# Altium schematic sheet EgSA-Cube3.SchDoc (part 3 of 3)
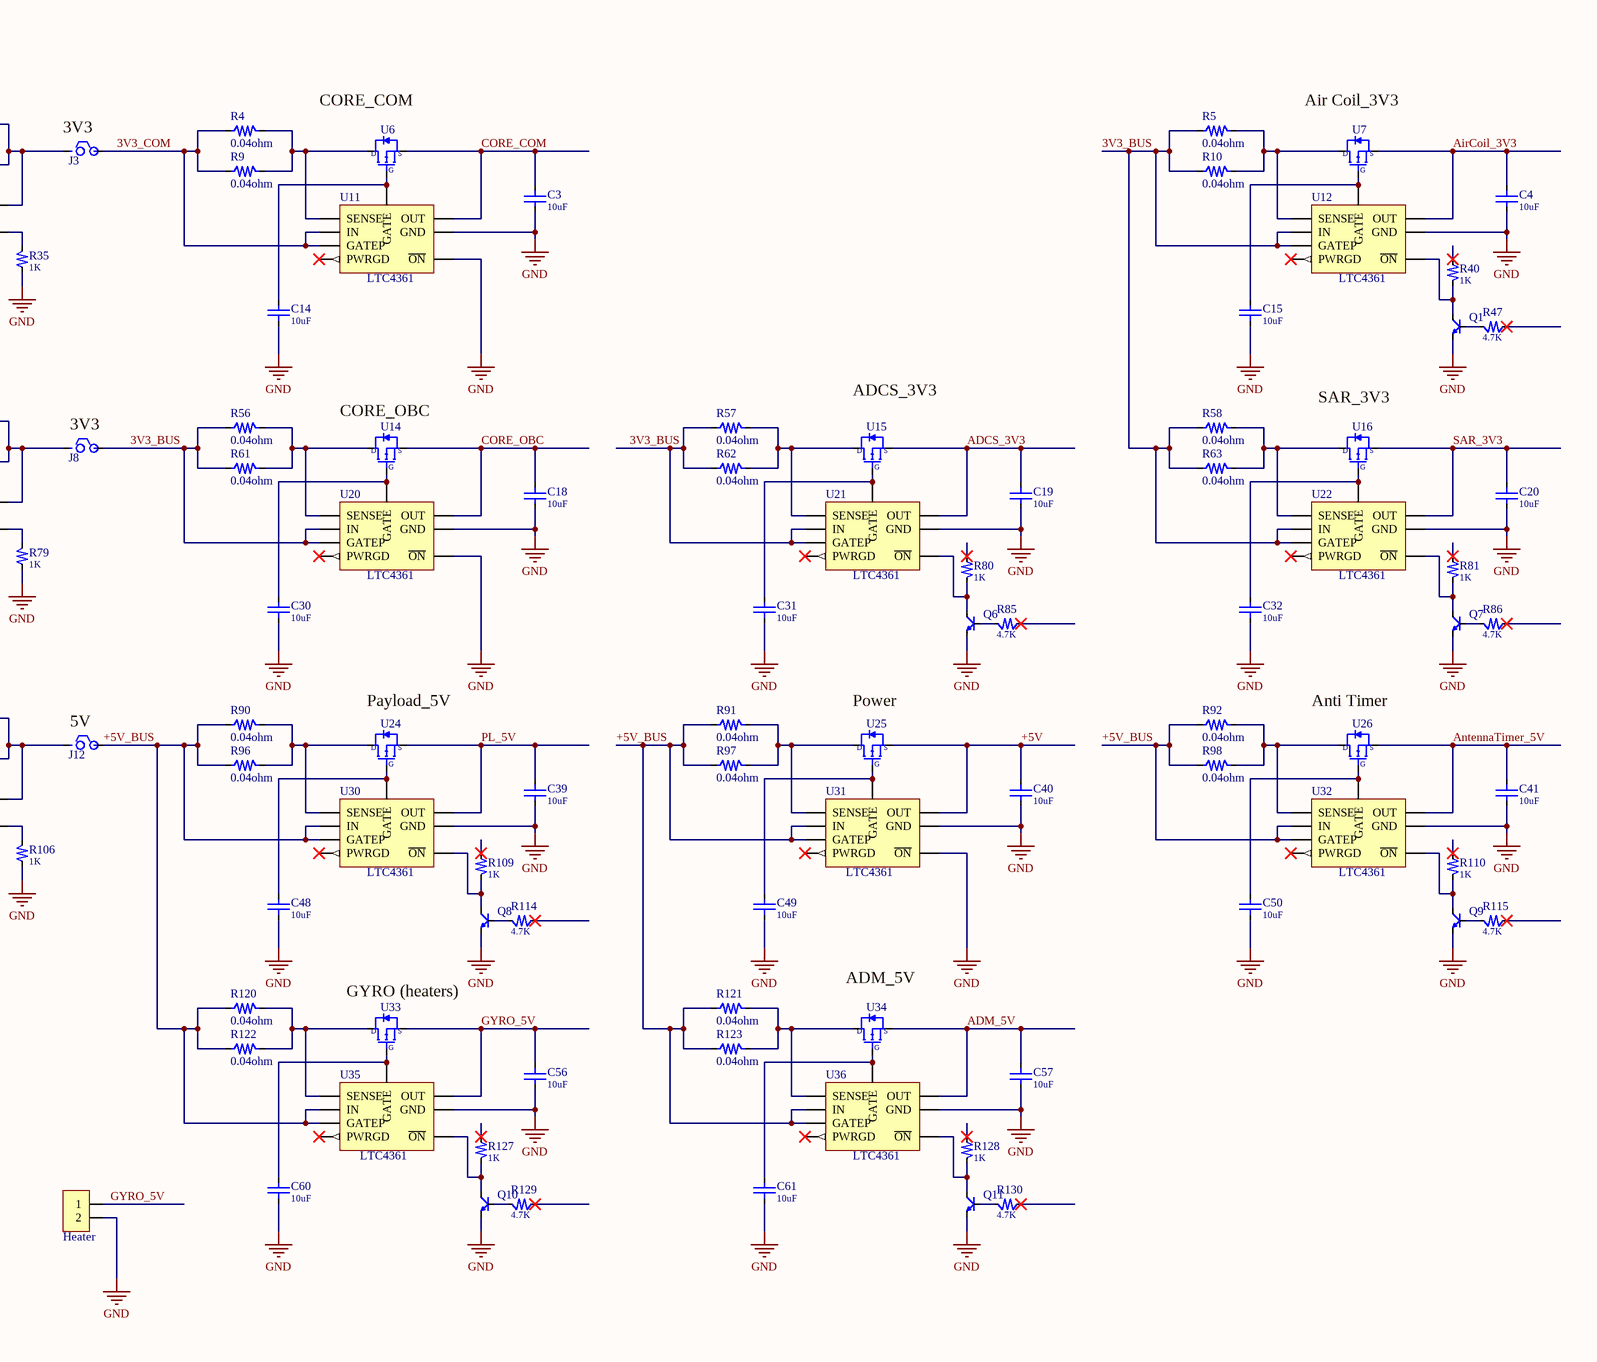
[diagram p5: EgSA-Cube3.SchDoc, bottom right]

## Library data of the parts (continued)
R51 R52 = ERJ-P6WF2702V: RES 27K OHM 1% 1/2W 0805; Manufacturer: Panasonic Electronic Components; Power (Watts): 0.5W, 1/2W; Temperature Coefficient: ±200ppm/°C; Supplier 1: Digi-Key; Manufacturer Part Number: ERJ-P6WF2702V; RoHS: RoHS Compliant; Category: Resistors; Stock 1: 2607; Pricing 1: 1=0.61, 10=0.465, 100=0.1956, 1000=0.10794, 2500=0.10119 (USD); Packaging: Cut Tape (CT); Part Status: Active; Tolerance: ±1%; Composition: Thick Film; Features: Automotive AEC-Q200, Pulse Withstanding; Operating Temperature: -55°C ~ 155°C; Package / Case: 0805 (2012 Metric); Supplier Device Package: 0805; Size / Dimension: 0.079" L x 0.049" W (2.00mm x 1.25mm); Height - Seated (Max): 0.030" (0.75mm); Failure Rate: -; ComponentLink1URL: https://industrial.panasonic.com/cdbs/www-data/pdf/RDO0000/RDO0000C337.pdf; ComponentLink1Description: https://industrial.panasonic.com/cdbs/www-data/pdf/RDO0000/RDO0000C337.pdf; Supplier Part Number 1: P16902CT-ND
R64 R72 = CRCW080520K0FKEAHP: RES 20K OHM 1% 1/2W 0805; Manufacturer: Vishay Dale; Resistance: 20kR; Temperature Coefficient: 100ppm/°C; Power Rating: 500mW; Voltage Rating: 150V; Max Power Dissipation: 333mW; Supplier 1: Digi-Key; Supplier Part Number 1: 541-20.0KTCT-ND; Manufacturer Part Number: CRCW080520K0FKEAHP; Stock 1: 10149; Pricing 1: 1=0.24, 10=0.204, 100=0.0798, 1000=0.0334, 2500=0.0306 (USD); Mount: Surface Mount; Case/Package: 0805; Weight: 0.000194oz; Contact Plating: Tin; Case Code (Imperial): 0805; Case Code (Metric): 2012; Min Operating Temperature: -55°C; Max Operating Temperature: 155°C; Tolerance: 1%; Composition: Thick Film; Packaging: Tape and Reel; Package Quantity: 10; Termination: SMD/SMT; Number of Terminations: 2; Features: Automotive AEC-Q200; Length: 2mm; Height: 0.024inch; Width: 1.2mm; Depth: 1.25mm; Radiation Hardening: No; Lead Free: Lead Free; ComponentLink1URL: http://www.vishay.com/docs/20043/crcwhpe3.pdf?src-supplier=Digi-Key; ComponentLink1Description: http://www.vishay.com/docs/20043/crcwhpe3.pdf?src-supplier=Digi-Key; ComponentLink2URL: http://www.vishay.com/docs/20043/crcwhpe3.pdf?src-supplier=Avnet; ComponentLink2Description: http://www.vishay.com/docs/20043/crcwhpe3.pdf?src-supplier=Avnet
R67 = ERJ-P06F1913V: RES 191K OHM 1% 1/2W 0805; Manufacturer: Panasonic; Manufacturer Part Number: ERJP06F1913V; Resistance: 191kR; Power Rating: 500mW; Voltage Rating: 150V; Temperature Coefficient: 100ppm/°C; Voltage Rating (DC): 400V; Supplier 1: Mouser; Supplier Part Number 1: 667-ERJ-P06F1913V; Stock 1: 9958; Pricing 1: 1=0.15, 10=0.086, 50=0.071, 100=0.048, 1000=0.022, 10000=0.016 (USD); Mount: Surface Mount; Case/Package: 0805; Case Code (Imperial): 0805; Case Code (Metric): 2012; Min Operating Temperature: -55°C; Max Operating Temperature: 155°C; Packaging: Tape and Reel; Tolerance: 1%; Package Quantity: 5000; Resistor Type: Thick Film; Length: 2mm; Width: 1.2mm; Height: 0.6mm; REACH SVHC: No SVHC; RoHS Compliant: Yes; ComponentLink1URL: http://www.farnell.com/datasheets/1801181.pdf?src-supplier=Element14; ComponentLink1Description: http://www.farnell.com/datasheets/1801181.pdf?src-supplier=Element14; ComponentLink2URL: http://www.farnell.com/datasheets/2059624.pdf?src-supplier=Farnell; ComponentLink2Description: http://www.farnell.com/datasheets/2059624.pdf?src-supplier=Farnell; ComponentLink3URL: http://www.mouser.com/ds/2/315/AOA0000C291-1101061.pdf?src-supplier=Mouser; ComponentLink3Description: http://www.mouser.com/ds/2/315/AOA0000C291-1101061.pdf?src-supplier=Mouser
R95 = CRCW08055K62FKEAHP: RES 5.62K OHM 1% 1/2W 0805; Manufacturer: Vishay Dale; Resistance: 5.62kR; Max Power Dissipation: 500mW; Temperature Coefficient: 100ppm/°C; Supplier 1: Mouser; Supplier Part Number 1: 71-CRCW08055K62FKEAH; Manufacturer Part Number: CRCW08055K62FKEAHP; Stock 1: 641; Pricing 1: 1=0.26, 10=0.222, 50=0.222, 100=0.086, 1000=0.033, 10000=0.025 (USD); Case/Package: 0805; Case Code (Metric): 2012; Case Code (Imperial): 0805; Min Operating Temperature: -55°C; Max Operating Temperature: 155°C; Package Quantity: 5000; Tolerance: 1%; Packaging: Cut Tape; Resistor Type: Thick Film; Number of Terminations: 2; Features: Automotive AEC-Q200; Series: CRCW-HP; Length: 0.079inch; Width: 0.049inch; Height: 0.024inch; Lead Free: Lead Free; RoHS Compliant: Yes; ComponentLink1URL: http://www.vishay.com/docs/20043/crcwhpe3.pdf?src-supplier=Digi-Key; ComponentLink1Description: http://www.vishay.com/docs/20043/crcwhpe3.pdf?src-supplier=Digi-Key
R103 = CRCW0805470KFKEAHP: RES 470K OHM 1% 1/2W 0805; Manufacturer: Vishay Dale; Resistance: 470kR; Power Rating: 330mW; Max Power Dissipation: 500mW; Temperature Coefficient: 100ppm/°C; Supplier 1: Mouser; Supplier Part Number 1: 71-CRCW0805470KFKEAH; Manufacturer Part Number: CRCW0805470KFKEAHP; Stock 1: 3950; Pricing 1: 1=0.26, 10=0.222, 50=0.222, 100=0.086, 1000=0.033, 10000=0.025 (USD); Mount: Surface Mount; Case/Package: 0805; Case Code (Metric): 2012; Case Code (Imperial): 0805; Contact Plating: Tin; Min Operating Temperature: -55°C; Max Operating Temperature: 155°C; Package Quantity: 5000; Tolerance: 1%; Packaging: Tape and Reel; Resistor Type: Thick Film; Number of Terminations: 2; Termination: Wraparound; Features: Automotive AEC-Q200; Series: CRCW-HP; Length: 0.079inch; Width: 0.049inch; Height: 0.024inch; Lead Free: Lead Free; RoHS Compliant: Yes; ComponentLink1URL: http://www.vishay.com/docs/20043/crcwhpe3.pdf?src-supplier=Digi-Key; ComponentLink1Description: http://www.vishay.com/docs/20043/crcwhpe3.pdf?src-supplier=Digi-Key
R107 = CRCW080512K4FKEAHP: RES SMD 12.4K OHM 1% 1/2W 0805; Manufacturer: Vishay Dale; Resistance: 12.4kR; Max Power Dissipation: 500mW; Temperature Coefficient: 100ppm/°C; Supplier 1: Digi-Key; Supplier Part Number 1: 541-12.4KTCT-ND; Manufacturer Part Number: CRCW080512K4FKEAHP; Stock 1: 1008; Pricing 1: 1=0.23, 10=0.192, 100=0.0752, 1000=0.0315, 2500=0.0289 (USD); Case/Package: 0805; Case Code (Metric): 2012; Case Code (Imperial): 0805; Min Operating Temperature: -55°C; Max Operating Temperature: 155°C; Package Quantity: 5000; Tolerance: 1%; Packaging: Tape and Reel; Resistor Type: Thick Film; Number of Terminations: 2; Features: Automotive AEC-Q200; Series: CRCW-HP; Length: 0.079inch; Width: 0.049inch; Height: 0.024inch; Lead Free: Lead Free; RoHS Compliant: Yes; ComponentLink1URL: http://www.vishay.com/docs/20043/crcwhpe3.pdf?src-supplier=Digi-Key; ComponentLink1Description: http://www.vishay.com/docs/20043/crcwhpe3.pdf?src-supplier=Digi-Key
R108 = CRCW08051M00FKEAHP: RES 1M OHM 1% 1/2W 0805; Manufacturer: Vishay Dale; Resistance: 1MR; Temperature Coefficient: 100ppm/°C; Power Rating: 330mW; Voltage Rating: 150V; Max Power Dissipation: 333mW; Supplier 1: Digi-Key; Supplier Part Number 1: 541-1.00MTCT-ND; Manufacturer Part Number: CRCW08051M00FKEAHP; Stock 1: 21204; Pricing 1: 1=0.23, 10=0.193, 100=0.0753, 1000=0.0315, 2500=0.0289 (USD); Mount: Surface Mount; Case/Package: 0805; Contact Plating: Tin; Weight: 0.000194oz; Case Code (Metric): 2012; Case Code (Imperial): 0805; Min Operating Temperature: -55°C; Max Operating Temperature: 155°C; Tolerance: 1%; Resistor Type: Thick Film; Package Quantity: 10; Packaging: Tape and Reel; Number of Terminations: 2; Termination: SMD/SMT; Features: Automotive AEC-Q200; Series: CRCW-HP; Length: 2mm; Width: 0.049inch; Height: 0.024inch; Radiation Hardening: No; Lead Free: Lead Free; RoHS Compliant: Yes; ComponentLink1URL: http://www.vishay.com/docs/20043/crcwhpe3.pdf?src-supplier=Digi-Key; ComponentLink1Description: http://www.vishay.com/docs/20043/crcwhpe3.pdf?src-supplier=Digi-Key; ComponentLink2URL: http://www.vishay.com/docs/20043/crcwhpe3.pdf?src-supplier=Avnet; ComponentLink2Description: http://www.vishay.com/docs/20043/crcwhpe3.pdf?src-supplier=Avnet; ComponentLink3URL: http://www.mouser.com/ds/2/427/crcwhpe3-46056.pdf?src-supplier=Mouser; ComponentLink3Description: http://www.mouser.com/ds/2/427/crcwhpe3-46056.pdf?src-supplier=Mouser
R111 = CRCW0805510KFKEAHP: RES 510K OHM 1% 1/2W 0805; Manufacturer: Vishay Dale; Resistance: 510kR; Power Rating: 330mW; Max Power Dissipation: 500mW; Temperature Coefficient: 100ppm/°C; Supplier 1: Digi-Key; Supplier Part Number 1: 541-510KTCT-ND; Manufacturer Part Number: CRCW0805510KFKEAHP; Stock 1: 3687; Pricing 1: 1=0.23, 10=0.193, 100=0.0753, 1000=0.0315, 2500=0.0289 (USD); Mount: Surface Mount; Case/Package: 0805; Case Code (Metric): 2012; Case Code (Imperial): 0805; Contact Plating: Tin; Min Operating Temperature: -55°C; Max Operating Temperature: 155°C; Package Quantity: 5000; Tolerance: 1%; Packaging: Tape and Reel; Resistor Type: Thick Film; Number of Terminations: 2; Termination: Wraparound; Features: Automotive AEC-Q200; Series: CRCW-HP; Length: 0.079inch; Width: 0.049inch; Height: 0.024inch; Lead Free: Lead Free; RoHS Compliant: Yes; ComponentLink1URL: http://www.vishay.com/docs/20043/crcwhpe3.pdf?src-supplier=Digi-Key; ComponentLink1Description: http://www.vishay.com/docs/20043/crcwhpe3.pdf?src-supplier=Digi-Key
R112 = ERJ-P06F7872V: RES 78.7 KOHM 1% 1/2W 0805; Manufacturer: Panasonic; Resistance: 78.7kR; Power Rating: 500mW; Voltage Rating: 150V; Temperature Coefficient: 100ppm/°C; Voltage Rating (DC): 400V; Supplier 1: Mouser; Supplier Part Number 1: 667-ERJ-P06F7872V; Manufacturer Part Number: ERJ-P06F7872V; Stock 1: 4900; Pricing 1: 1=0.17, 10=0.098, 50=0.081, 100=0.055, 1000=0.025, 10000=0.017 (USD); Mount: Surface Mount; Case/Package: 0805; Case Code (Imperial): 0805; Case Code (Metric): 2012; Min Operating Temperature: -55°C; Max Operating Temperature: 155°C; Tolerance: 1%; Packaging: Tape and Reel; Package Quantity: 5000; Resistor Type: Thick Film; Length: 2mm; Width: 1.2mm; Height: 0.6mm; REACH SVHC: No SVHC; ComponentLink1URL: http://www.mouser.com/ds/2/315/AOA0000CE4-64075.pdf?src-supplier=Mouser; ComponentLink1Description: http://www.mouser.com/ds/2/315/AOA0000CE4-64075.pdf?src-supplier=Mouser; ComponentLink2URL: http://www.farnell.com/datasheets/1801181.pdf?src-supplier=Element14; ComponentLink2Description: http://www.farnell.com/datasheets/1801181.pdf?src-supplier=Element14
R113 = CRCW08059K09FKEAHP: RES 9.09K OHM 1% 1/2W 0805; Manufacturer: Vishay Dale; Resistance: 9.09kR; Max Power Dissipation: 333mW; Temperature Coefficient: 100ppm/°C; Supplier 1: Digi-Key; Supplier Part Number 1: 541-CRCW08059K09FKEAHPCT-ND; Manufacturer Part Number: CRCW08059K09FKEAHP; Stock 1: 4900; Pricing 1: 1=0.23, 10=0.193, 100=0.0753, 1000=0.0315, 2500=0.0289 (USD); Case/Package: 0805; Package Quantity: 5000; Tolerance: 1%; Packaging: Tape and Reel; Resistor Type: Thick Film; Number of Terminations: 2; Features: Automotive AEC-Q200; Series: CRCW-HP; Length: 0.079inch; Width: 0.049inch; Height: 0.024inch; Lead Free: Lead Free; RoHS Compliant: Yes; ComponentLink1URL: http://www.vishay.com/docs/20043/crcwhpe3.pdf?src-supplier=Digi-Key; ComponentLink1Description: http://www.vishay.com/docs/20043/crcwhpe3.pdf?src-supplier=Digi-Key
R116 = ERJ-P06F1601V: RES 1.6K OHM 1% 1/2W 0805; Manufacturer: KEMET; Manufacturer Part Number: C0805C472K4RAC7800; Dielectric Material: Ceramic; Capacitance: 4.7nF; Tolerance: 10%; Dielectric: X7R; Voltage Rating (DC): 16V; Supplier 1: Digi-Key; Supplier Part Number 1: 399-14607-1-ND; Stock 1: 904; Pricing 1: 1=0.3, 10=0.207, 50=0.1378, 100=0.1171, 500=0.0826, 1000=0.0723 (USD); Mount: Surface Mount; Case/Package: 0805; Min Operating Temperature: -55°C; Max Operating Temperature: 125°C; Packaging: Tape and Reel; Construction: Flat; Length: 2mm; Height: 0.78mm; Depth: 1.25mm; Radiation Hardening: No; ComponentLink1URL: http://components.arrow.com/part/dataview/0323_00331522?src-supplier=Arrow+Europe; ComponentLink1Description: http://components.arrow.com/part/dataview/0323_00331522?src-supplier=Arrow+Europe; ComponentLink2URL: http://capacitoredge.kemet.com/capedge2/DataSheet?pn=C0805C472K4RACTU&src-supplier=Avnet+Europe; ComponentLink2Description: http://capacitoredge.kemet.com/capedge2/DataSheet?pn=C0805C472K4RACTU&src-supplier=Avnet+Europe
R117 = ERJ-P06F1053V: RES 105 KOHM 1% 1/2W 0805; Manufacturer: Panasonic; Manufacturer Part Number: ERJP06F1053V; Resistance: 105kR; Power Rating: 500mW; Voltage Rating: 150V; Temperature Coefficient: 100ppm/°C; Voltage Rating (DC): 400V; Supplier 1: Mouser; Supplier Part Number 1: 667-ERJ-P06F1053V; Stock 1: 14770; Pricing 1: 1=0.17, 10=0.09, 50=0.075, 100=0.05, 1000=0.024, 10000=0.017 (USD); Mount: Surface Mount; Case/Package: 0805; Case Code (Imperial): 0805; Case Code (Metric): 2012; Min Operating Temperature: -55°C; Max Operating Temperature: 155°C; Tolerance: 1%; Packaging: Tape and Reel; Package Quantity: 5000; Resistor Type: Thick Film; Length: 2mm; Width: 1.2mm; Height: 0.6mm; REACH SVHC: No SVHC; ComponentLink1URL: http://www.farnell.com/datasheets/1801181.pdf?src-supplier=Element14; ComponentLink1Description: http://www.farnell.com/datasheets/1801181.pdf?src-supplier=Element14; ComponentLink2URL: http://www.mouser.com/ds/2/315/AOA0000C291-1101061.pdf?src-supplier=Mouser; ComponentLink2Description: http://www.mouser.com/ds/2/315/AOA0000C291-1101061.pdf?src-supplier=Mouser; ComponentLink3URL: http://www.farnell.com/datasheets/2059624.pdf?src-supplier=Farnell; ComponentLink3Description: http://www.farnell.com/datasheets/2059624.pdf?src-supplier=Farnell
SSW2 = 53261-0371: CONN HEADER SMD R/A 3POS 1.25MM; Manufacturer: Molex; Manufacturer Series: 53261; Number of Contacts: 3; Connector Type: Blade Pin; Contact Resistance: 20mR; Option: General Purpose; Current Rating: 1A; Voltage Rating: 125V; Mixed Contacts: No; Number of Rows Loaded: 1; Insulation Resistance: 100MR; Supplier 1: Mouser; Supplier Part Number 1: 538-53261-0371; Manufacturer Part Number: 53261-0371; Stock 1: 43703; Pricing 1: 1=0.57, 10=0.426, 50=0.426, 100=0.373, 1000=0.274, 10000=0.221 (USD); Mount: Surface Mount,Board; Contact Plating: Tin; Contact Material: Bronze,Tin; Color: Natural; Housing Color: Natural; Housing Material: Nylon; Min Operating Temperature: -40°C; Max Operating Temperature: 85°C; Termination: Solder; Number of Rows: 1; Orientation: Right Angle; Packaging: Tape and Reel; Number of Positions: 3; Series: PicoBlade; Contact Type: Blade Pin; Contact Gender: Male; Mounting Style: STRAIGHT; Filter Feature: No; Voltage Rating (AC): 125V; Working Voltage: 125V; Length: 8.9mm; Pitch: 1.25mm; Depth: 5.2mm; Radiation Hardening: No; Flammability Rating: UL94 V-0; RoHS Compliant: Yes; MIL Conformance: No; DIN Conformance: No; IEC Conformance: No; REACH SVHC: Unknown; ComponentLink1URL: https://www.molex.com/pdm_docs/pk/SPK-53261-002-001.pdf?src-supplier=Digi-Key; ComponentLink1Description: https://www.molex.com/pdm_docs/pk/SPK-53261-002-001.pdf?src-supplier=Digi-Key; ComponentLink2URL: http://www.jameco.com/Jameco/Products/ProdDS/1302094.pdf?src-supplier=Jameco; ComponentLink2Description: http://www.jameco.com/Jameco/Products/ProdDS/1302094.pdf?src-supplier=Jameco; ComponentLink3URL: https://www.molex.com/pdm_docs/sd/532610371_sd.pdf?src-supplier=Digi-Key; ComponentLink3Description: https://www.molex.com/pdm_docs/sd/532610371_sd.pdf?src-supplier=Digi-Key; ComponentLink4URL: http://www.onlinecomponents.com/productFiles/mf-MOL/1620532610371_pcb_headers.pdf?src-supplier=Onlinecomponents.com; ComponentLink4Description: http://www.onlinecomponents.com/productFiles/mf-MOL/1620532610371_pcb_headers.pdf?src-supplier=Onlinecomponents.com; ComponentLink5URL: http://components.arrow.com/part/dataview/40924515S9851323N3303?src-supplier=Arrow+Electronics; ComponentLink5Description: http://components.arrow.com/part/dataview/40924515S9851323N3303?src-supplier=Arrow+Electronics; ComponentLink6URL: http://www.molex.com/webdocs/datasheets/pdf/en-us/0532610371_PCB_HEADERS.pdf?src-supplier=Avnet; ComponentLink6Description: http://www.molex.com/webdocs/datasheets/pdf/en-us/0532610371_PCB_HEADERS.pdf?src-supplier=Avnet; ComponentLink7URL: http://uk.rs-online.com/webdocs/1380/0900766b8138010c.pdf?src-supplier=RSComponents; ComponentLink7Description: http://uk.rs-online.com/webdocs/1380/0900766b8138010c.pdf?src-supplier=RSComponents
U1-U4 = IRF7329TRPBF: MOSFET 2P-CH 12V 9.2A 8-SOIC; Manufacturer: International Rectifier; Rise Time: 8.6ns; Fall Time: 260ns; Turn-On Delay Time: 10ns; Turn-Off Delay Time: 340ns; Gate to Source Voltage (Vgs): 8V; Rds On Max: 17mR; Input Capacitance: 3.45nF; Number of Elements: 2; Max Power Dissipation: 2W; Element Configuration: Dual; Drain to Source Breakdown Voltage: -12V; Current Rating: -9.2A; Supplier 1: Digi-Key; Supplier Part Number 1: IRF7329PBFCT-ND; Manufacturer Part Number: IRF7329TRPBF; Stock 1: 21693; Pricing 1: 1=1.23, 10=1.007, 25=0.988, 100=0.7831, 500=0.6638, 1000=0.5407 (USD); Mount: Surface Mount; Case/Package: SOIC; Number of Pins: 8; Min Operating Temperature: -55°C; Max Operating Temperature: 150°C; Continuous Drain Current (ID): 9.2A; Package Quantity: 1; Packaging: Tape and Reel; Drain to Source Voltage (Vdss): 12V; Drain to Source Resistance: 17mR; Power Dissipation: 2W; Voltage Rating (DC): -12V; Series: HEXFET®; Length: 5mm; Width: 4mm; Height: 1.5mm; Radiation Hardening: No; Lead Free: Lead Free; RoHS Compliant: Yes; ComponentLink1URL: https://www.infineon.com/dgdl/irf7329pbf.pdf?fileId=5546d462533600a4015355f617841b55&src-supplier=Digi-Key; ComponentLink1Description: https://www.infineon.com/dgdl/irf7329pbf.pdf?fileId=5546d462533600a4015355f617841b55&src-supplier=Digi-Key; ComponentLink2URL: https://www.verical.com/server-webapp/html/getDatasheet?partID=357970&src-supplier=Verical; ComponentLink2Description: https://www.verical.com/server-webapp/html/getDatasheet?partID=357970&src-supplier=Verical; ComponentLink3URL: http://datasheet.iiic.cc/international_rectifier/IRF7329TRPBF.pdf?src-supplier=IIIC; ComponentLink3Description: http://datasheet.iiic.cc/international_rectifier/IRF7329TRPBF.pdf?src-supplier=IIIC
U5 U18 = TPS621361RGXR: IC REG BUCK ADJUSTABLE 4A 11VQFN; Manufacturer: Texas Instruments; Output Configuration: Positive; Number of Outputs: 1; Min Input Voltage: 3V; Max Input Voltage: 17V; Min Output Voltage: 800mV; Max Output Voltage: 12V; Switching Frequency: 1MHz; Synchronous Rectifier: Yes; Supplier 1: Digi-Key; Supplier Part Number 1: 296-50117-1-ND; Manufacturer Part Number: TPS621361RGXR; Stock 1: 4700; Pricing 1: 1=2.28, 10=2.051, 25=1.9344, 100=1.5476, 250=1.3542, 500=1.3155, 1000=1.0446 (USD); Mount: Surface Mount; Case/Package: VQFN; Number of Pins: 11; Min Operating Temperature: -40°C; Max Operating Temperature: 125°C; Output Type: Adjustable; Packaging: Cut Tape; Output Current: 4A; RoHS Compliant: Yes; ComponentLink1URL: http://www.ti.com/lit/ds/symlink/tps62136.pdf?src-supplier=Digi-Key; ComponentLink1Description: http://www.ti.com/lit/ds/symlink/tps62136.pdf?src-supplier=Digi-Key
U6 U7 U14-U16 U24-U26 U33 U34 = IRFML8244TRPBF: MOSFET N-CH 25V 5.8A SOT23; Manufacturer: International Rectifier; Rise Time: 2.1ns; Gate to Source Voltage (Vgs): 20V; Turn-On Delay Time: 2.7ns; Turn-Off Delay Time: 9ns; Fall Time: 2.9ns; Nominal Vgs: 1.7V; Rds On Max: 24mR; Input Capacitance: 430pF; Max Power Dissipation: 1.25W; Number of Elements: 1; Drain to Source Resistance: 41mR; Element Configuration: Single; Recovery Time: 17ns; Supplier 1: Digi-Key; Supplier Part Number 1: IRFML8244TRPBFCT-ND; Manufacturer Part Number: IRFML8244TRPBF; Stock 1: 12011; Pricing 1: 1=0.47, 10=0.357, 25=0.3216, 100=0.1697, 500=0.1503, 1000=0.117 (USD); Mount: Surface Mount; Case/Package: SOT-23; Number of Pins: 3; Min Operating Temperature: -55°C; Max Operating Temperature: 150°C; Continuous Drain Current (ID): 5.8A; Packaging: Tape and Reel; Package Quantity: 1; Drain to Source Breakdown Voltage: 25V; Power Dissipation: 1.25W; Drain to Source Voltage (Vdss): 25V; Threshold Voltage: 1.7V; On-State Resistance: 41MR; Length: 3.04mm; Height: 1.02mm; Width: 1.4mm; Radiation Hardening: No; REACH SVHC: No SVHC; Lead Free: Lead Free; ComponentLink1URL: http://farnell.com//datasheets/1911843.pdf?src-supplier=Farnell; ComponentLink1Description: http://farnell.com//datasheets/1911843.pdf?src-supplier=Farnell
U8 U17 U28 = LMZ22005TZX/NOPB: DC DC CONVERTER 0.8-6V; Manufacturer: TI National Semiconductor; Output Current: 5A; Max Input Voltage: 20V; Output Voltage: 6V; Number of Outputs: 1; Output Power: 30W; Efficiency: 92%; Switching Frequency: 950kHz; Supplier 1: Digi-Key; Supplier Part Number 1: 296-43603-1-ND; Manufacturer Part Number: LMZ22005TZX/NOPB; Stock 1: 2457; Pricing 1: 1=9.19, 5=9.124, 10=9.055, 25=8.9156, 50=8.637, 100=7.8012, 250=7.6619 (USD); Mount: Surface Mount; Number of Pins: 7; Contact Plating: Tin,Matte; Min Operating Temperature: -40°C; Max Operating Temperature: 85°C; Min Input Voltage: 6V; Packaging: Tape and Reel; Package Quantity: 500; Voltage - Output 1: 6V; Max Power Dissipation: 30W; Features: UVLO; Length: 0.4inch; Height: 0.18inch; Width: 0.54inch; Lead Free: Lead Free; ComponentLink1URL: http://www.ti.com/lit/ds/symlink/lmz22005.pdf?src-supplier=Digi-Key; ComponentLink1Description: http://www.ti.com/lit/ds/symlink/lmz22005.pdf?src-supplier=Digi-Key
U9 U10 U19 U29 = LT6106HS5#TRPBF: IC OPAMP CURR SENSE TSOT23-5; Manufacturer: Linear Technology; Manufacturer Part Number: LT6106HS5#TRMPBF; Amplifier Type: Current Sense; Current - Supply: 70µA; Voltage - Supply, Single/Dual (±): 2.7 V ~ 36 V; Supplier 1: Digi-Key; RoHS: RoHS Compliant; Category: Integrated Circuits (ICs); Stock 1: 7462; Pricing 1: 1=2.3, 25=2.0504, 100=1.3586, 250=1.24544 (USD); Packaging: Cut Tape (CT); Part Status: Active; Output Type: -; Slew Rate: -; Operating Temperature: -40°C ~ 125°C; Mounting Type: Surface Mount; Package / Case: SOT-23-5 Thin, TSOT-23-5; Supplier Device Package: TSOT-23-5; Base Part Number: LT6106; ComponentLink1URL: http://www.linear.com/docs/24992; ComponentLink1Description: http://www.linear.com/docs/24992; Supplier Part Number 1: LT6106HS5#TRMPBFCT-ND
U11 U12 U20-U22 U30-U32 U35 U36 = LTC4361HTS8-2#TRMPBF: IC OVERVOLT PROT CONT TSOT23-8; Manufacturer: Linear Technology; Manufacturer Part Number: LTC4361ITS8-2#TRMPBF; Current - Supply: 220µA; Voltage - Supply: 2.5 V ~ 80 V; Supplier 1: Digi-Key; RoHS: RoHS Compliant; Category: Integrated Circuits (ICs); Stock 1: 1487; Pricing 1: 1=3.87, 25=3.4596, 100=2.2889, 250=2.09816 (USD); Packaging: Cut Tape (CT); Part Status: Active; Applications: Handheld/Mobile Devices; Operating Temperature: -40°C ~ 85°C; Mounting Type: Surface Mount; Package / Case: SOT-23-8 Thin, TSOT-23-8; Supplier Device Package: TSOT-23-8; Base Part Number: LTC4361-2; ComponentLink1URL: http://www.linear.com/docs/29266; ComponentLink1Description: http://www.linear.com/docs/29266; Supplier Part Number 1: LTC4361ITS8-2#TRMPBFCT-ND
U13 = G6SK-2G DC5: RELAY TELECOM DPDT 2A 5V; Manufacturer: Omron Electronics Inc-EMC Div; Coil Type: Latching, Dual Coil; Coil Voltage: 5VDC; Contact Form: DPDT (2 Form C); Switching Voltage: 250VAC, 220VDC - Max; Turn On Voltage (Max): 3.75 VDC; Coil Power: 200 mW; Supplier 1: Digi-Key; Manufacturer Part Number: G6SK-2G DC5; RoHS: RoHS Compliant; Category: Relays; Stock 1: 0; Pricing 1: 1000=2.65888 (USD); Packaging: Tube; Part Status: Active; Relay Type: Telecom; Turn Off Voltage (Min): -; Features: -; Mounting Type: Surface Mount; Termination Style: J Lead; Operating Temperature: -40°C ~ 85°C; Contact Material: Silver (Ag), Gold (Au); ComponentLink1URL: http://omronfs.omron.com/en_US/ecb/products/pdf/en-g6s.pdf; ComponentLink1Description: http://omronfs.omron.com/en_US/ecb/products/pdf/en-g6s.pdf; Supplier Part Number 1: G6SK-2G-DC5-ND
U23 = INA286AQDRQ1: IC CURRENT SHUNT MONITOR 8SOIC; Manufacturer: Texas Instruments; Number of Amplifiers: 1; Input Bias Current: 25uA; Bandwidth: 10kHz; Min Supply Voltage: 2.7V; Max Supply Voltage: 18V; Input Offset Voltage (Vos): 20uV; Common Mode Rejection Ratio: 140dB; Accuracy: 0.4%; Supplier 1: Digi-Key; Supplier Part Number 1: 296-42504-1-ND; Manufacturer Part Number: INA286AQDRQ1; Stock 1: 1000; Pricing 1: 1=3.91, 10=3.511, 25=3.3188, 100=2.7288, 250=2.4485, 500=2.36, 1000=1.9618 (USD); Mount: Surface Mount; Case/Package: SOIC; Number of Pins: 8; Min Operating Temperature: -40°C; Max Operating Temperature: 125°C; Packaging: Cut Tape; REACH SVHC: No SVHC; Lead Free: Lead Free; ComponentLink1URL: http://www.ti.com/general/docs/lit/getliterature.tsp?genericPartNumber=INA286-Q1&&fileType=pdf&src-supplier=Farnell; ComponentLink1Description: http://www.ti.com/general/docs/lit/getliterature.tsp?genericPartNumber=INA286-Q1&&fileType=pdf&src-supplier=Farnell; ComponentLink2URL: http://www.ti.com/lit/ds/symlink/ina283-q1.pdf?src-supplier=Digi-Key; ComponentLink2Description: http://www.ti.com/lit/ds/symlink/ina283-q1.pdf?src-supplier=Digi-Key; ComponentLink3URL: http://www.ti.com/general/docs/lit/getliterature.tsp?genericPartNumber=INA284-Q1&&fileType=pdf&src-supplier=Avnet; ComponentLink3Description: http://www.ti.com/general/docs/lit/getliterature.tsp?genericPartNumber=INA284-Q1&&fileType=pdf&src-supplier=Avnet; ComponentLink4URL: http://www.ti.com/general/docs/lit/getliterature.tsp?genericPartNumber=INA286-Q1&&fileType=pdf&src-supplier=Element14; ComponentLink4Description: http://www.ti.com/general/docs/lit/getliterature.tsp?genericPartNumber=INA286-Q1&&fileType=pdf&src-supplier=Element14
U27 = LTC3119EUFD#PBF: IC REG BCK BST ADJ 5A 28QFN; Manufacturer: Analog Devices / Linear Technology; Supplier 1: Digi-Key; Supplier Part Number 1: LTC3119EUFD#PBF-ND; Manufacturer Part Number: LTC3119EUFD#PBF; Stock 1: 0; Pricing 1: 1=14.26, 10=13.105, 25=12.5616, 100=10.5245, 250=9.8455, 500=9.1665, 1000=9.0307 (USD); RoHS Compliant: Yes; ComponentLink1URL: http://www.linear.com/docs/56069?src-supplier=Digi-Key; ComponentLink1Description: http://www.linear.com/docs/56069?src-supplier=Digi-Key
U37 U38 = CD74HC4051QPWRQ1: IC MUX/DEMUX 8X1 16TSSOP; Manufacturer: Texas Instruments; Multiplexer/Demultiplexer Circuit: 8:1; On-State Resistance (Max): 130 Ohm; Channel-to-Channel Matching (&Delta;Ron): 5 Ohm; Voltage - Supply, Single (V+): 2 V ~ 6 V; Voltage - Supply, Dual (V±): ±1 V ~ 5 V; -3db Bandwidth: 180MHz; Channel Capacitance (CS(off), CD(off)): 25pF; Current - Leakage (IS(off)) (Max): 400nA; Supplier 1: Digi-Key; Manufacturer Part Number: CD74HC4051QPWRQ1; RoHS: RoHS Compliant; Category: Integrated Circuits (ICs); Stock 1: 59; Pricing 1: 1=0.58, 10=0.51, 100=0.3909, 500=0.309, 1000=0.2472 (USD); Packaging: Digi-Reel®; Part Status: Active; Switch Circuit: -; Switch Time (Ton, Toff) (Max): -; Charge Injection: -; Crosstalk: -; Operating Temperature: -40°C ~ 125°C (TA); Package / Case: 16-TSSOP (0.173", 4.40mm Width); Supplier Device Package: 16-TSSOP; Base Part Number: 74HC4051; ComponentLink1URL: http://www.ti.com/lit/ds/symlink/cd74hc4051-q1.pdf; ComponentLink1Description: http://www.ti.com/lit/ds/symlink/cd74hc4051-q1.pdf; Supplier Part Number 1: 296-31590-6-ND